# EAGLE design sdlogger (EAGLE 5.10)
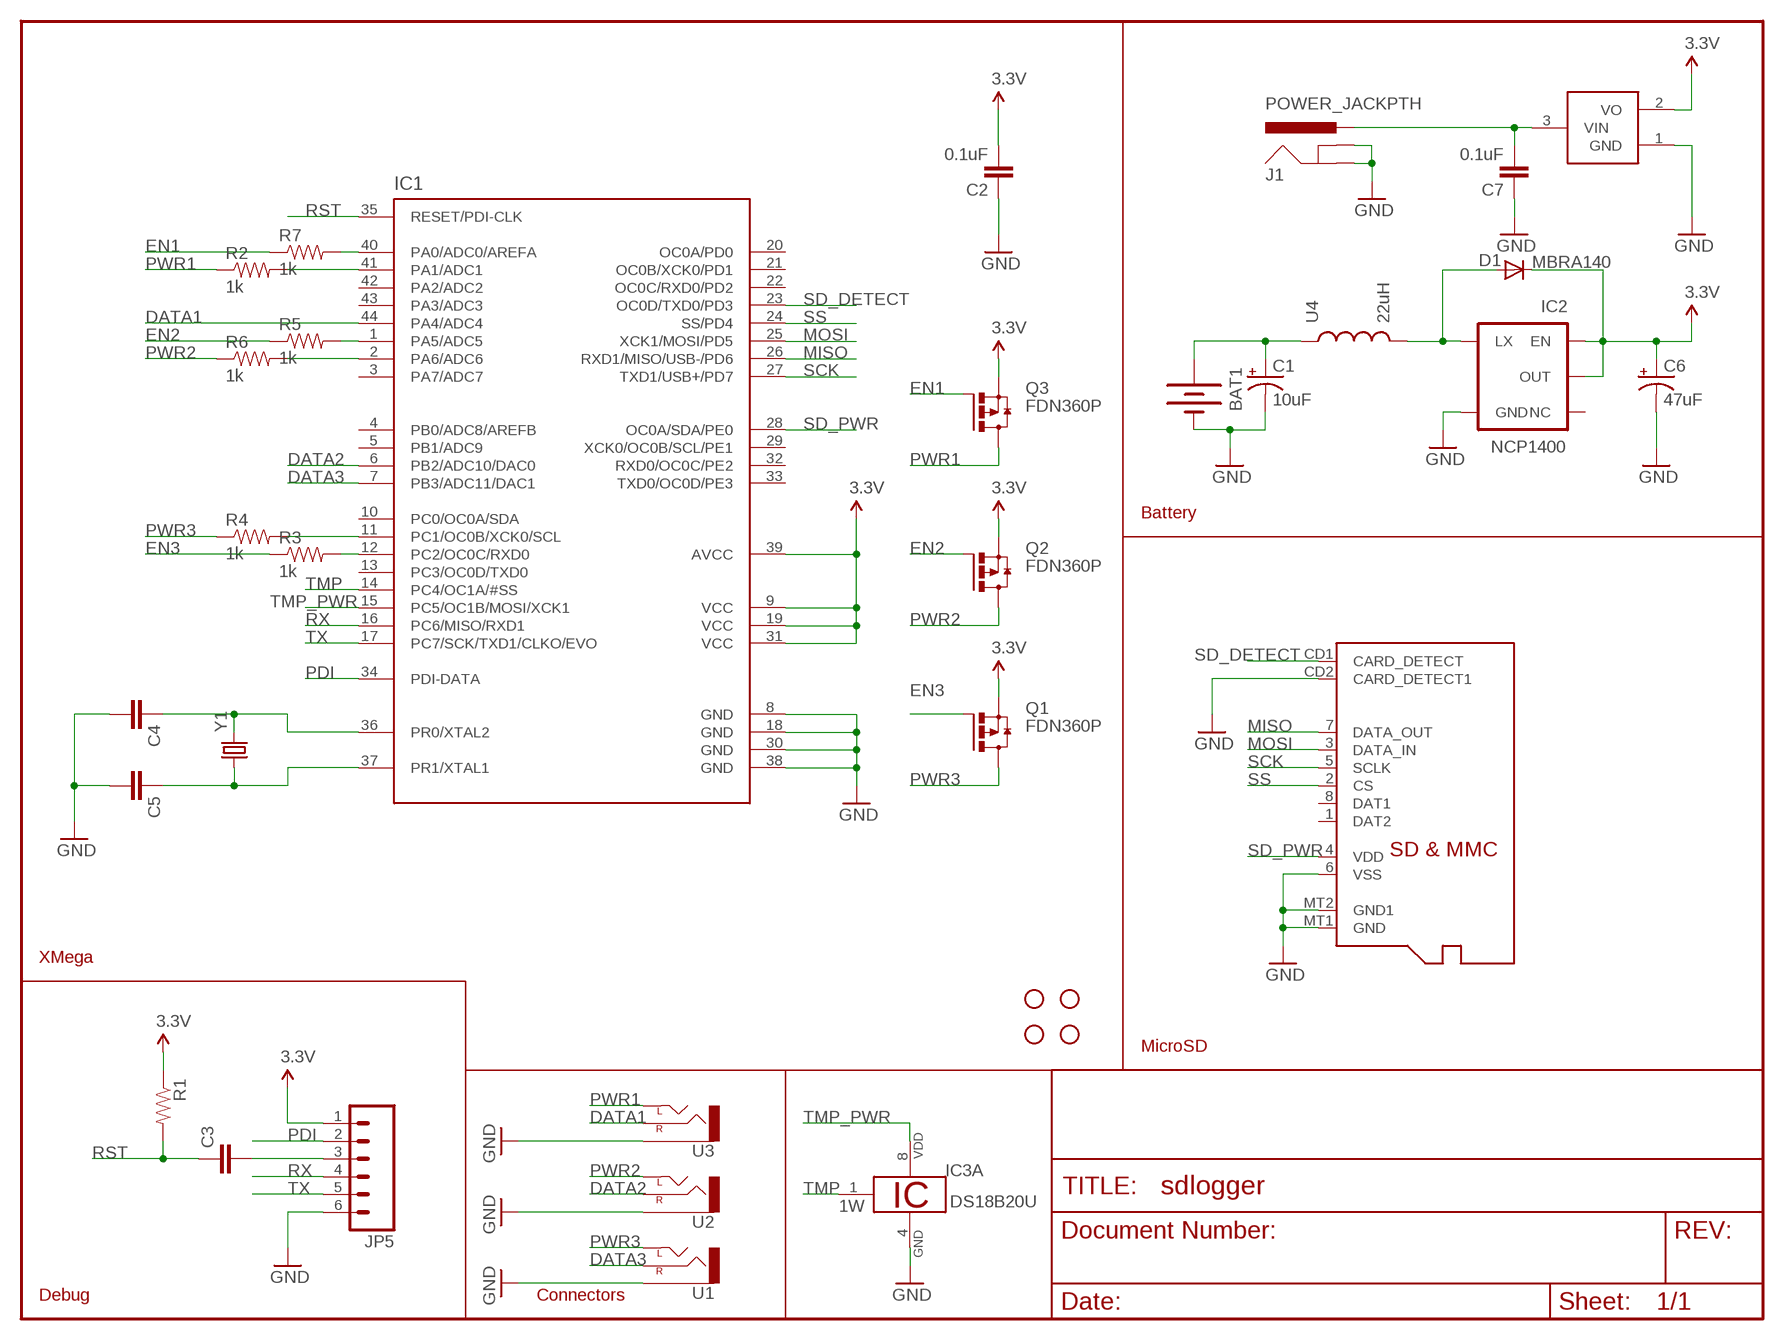
[diagram p0: schematic, sheet 1]

## Parts
BAT1  BATTERY20SMD  [BATTCON_20MM]
C1  10uF  CAP_POL1206  [EIA3216]
C2  0.1uF  CAP0603-CAP  [0603-CAP]
C3  CAP0603-CAP  [0603-CAP]
C4  CAP0603-CAP  [0603-CAP]
C5  CAP0603-CAP  [0603-CAP]
C6  47uF  CAP_POL1206  [EIA3216]
C7  0.1uF  CAP0603-CAP  [0603-CAP]
D1  MBRA140  DIODESMA  [SMA-DIODE]
IC1  ATXMEGAXXA4U  [TQFP-44]
IC2  NCP1400  V_REG_NCP1400SOT23-5  [SOT23-5]
IC3  DS18B20U  [UMAX8]
J1  POWER_JACKPTH  [POWER_JACK_PTH]
JP1  STAND-OFF  [STAND-OFF]
JP2  STAND-OFF  [STAND-OFF]
JP3  STAND-OFF  [STAND-OFF]
JP4  STAND-OFF  [STAND-OFF]
JP5  M06LONGPADS  [1X06_LONGPADS]
Q1  FDN360P  [SUPER-SOT3]
Q2  FDN360P  [SUPER-SOT3]
Q3  FDN360P  [SUPER-SOT3]
R1  RESISTOR0603-RES  [0603-RES]
R2  1k  RESISTOR0603-RES  [0603-RES]
R3  1k  RESISTOR0603-RES  [0603-RES]
R4  1k  RESISTOR0603-RES  [0603-RES]
R5  1k  RESISTOR0603-RES  [0603-RES]
R6  1k  RESISTOR0603-RES  [0603-RES]
R7  1k  RESISTOR0603-RES  [0603-RES]
U1  AUDIO-JACK2.5MM  [STEREOJACK2.5MM_STEREOJACK2.5MM]
U2  AUDIO-JACK2.5MM  [STEREOJACK2.5MM_STEREOJACK2.5MM]
U3  AUDIO-JACK2.5MM  [STEREOJACK2.5MM_STEREOJACK2.5MM]
U4  22uH  INDUCTORCR54  [CR54]
U$1  MICROSD  [MICROSD]
U$3  VREG  [SOT23-3]
Y1  CRYSTAL5X3  [CRYSTAL-SMD-5X3]

## Nets
3.3V: C2.2 C6.A(+) D1.C IC1.9(VCC) IC1.19(VCC) IC1.31(VCC) IC1.39(AVCC) IC2.1(EN) IC2.2(OUT) JP5.1 Q1.2(S) Q2.2(S) Q3.2(S) R1.1 U$3.2(VO)
BAT: BAT1.1(+) C1.A(+) U4.P$1
DATA1: IC1.44(PA4/ADC4) U3.TIP(RIGHT)
DATA2: IC1.6(PB2/ADC10/DAC0) U2.TIP(RIGHT)
DATA3: IC1.7(PB3/ADC11/DAC1) U1.TIP(RIGHT)
DC: C7.2 J1.PWR U$3.3(VIN)
EN1: Q3.1(G) R7.1
EN2: Q2.1(G) R5.1
EN3: Q1.1(G) R3.1
GND: BAT1.2(-) C1.C(-) C2.1 C4.2 C5.2 C6.C(-) C7.1 IC1.8(GND) IC1.18(GND) IC1.30(GND) IC1.38(GND) IC2.4(GND) IC3.4 J1.GND J1.GNDBREAK JP5.6 U1.RING1(SLEEVE) U2.RING1(SLEEVE) U3.RING1(SLEEVE) U$1.6(VSS) U$1.CD2(CARD_DETECT1) U$1.MT1(GND) U$1.MT2(GND1) U$3.1(GND)
MISO: IC1.26(RXD1/MISO/USB-/PD6) U$1.7(DATA_OUT)
MOSI: IC1.25(XCK1/MOSI/PD5) U$1.3(DATA_IN)
N$1: C3.2 JP5.3
N$2: C4.1 IC1.36(PR0/XTAL2) Y1.3
N$3: C5.1 IC1.37(PR1/XTAL1) Y1.1
N$4: D1.A IC2.5(LX) U4.P$2
N$5: IC1.41(PA1/ADC1) R2.2
N$6: IC1.11(PC1/OC0B/XCK0/SCL) R4.2
N$7: IC1.12(PC2/OC0C/RXD0) R3.2
N$8: IC1.1(PA5/ADC5) R5.2
N$9: IC1.2(PA6/ADC6) R6.2
N$10: IC1.40(PA0/ADC0/AREFA) R7.2
PDI: IC1.34(PDI-DATA) JP5.2
PWR1: Q3.3(D) R2.1 U3.SHIELD(LEFT)
PWR2: Q2.3(D) R6.1 U2.SHIELD(LEFT)
PWR3: Q1.3(D) R4.1 U1.SHIELD(LEFT)
RST: C3.1 IC1.35(RESET/PDI-CLK) R1.2
RX: IC1.16(PC6/MISO/RXD1) JP5.4
SCK: IC1.27(TXD1/USB+/PD7) U$1.5(SCLK)
SD_DETECT: IC1.23(OC0D/TXD0/PD3) U$1.CD1(CARD_DETECT)
SD_PWR: IC1.28(OC0A/SDA/PE0) U$1.4(VDD)
SS: IC1.24(SS/PD4) U$1.2(CS)
TMP: IC1.14(PC4/OC1A/#SS) IC3.1
TMP_PWR: IC1.15(PC5/OC1B/MOSI/XCK1) IC3.8
TX: IC1.17(PC7/SCK/TXD1/CLKO/EVO) JP5.5
Unconnected: IC1.3(PA7/ADC7) IC1.4(PB0/ADC8/AREFB) IC1.5(PB1/ADC9) IC1.10(PC0/OC0A/SDA) IC1.13(PC3/OC0D/TXD0) IC1.20(OC0A/PD0) IC1.21(OC0B/XCK0/PD1) IC1.22(OC0C/RXD0/PD2) IC1.29(XCK0/OC0B/SCL/PE1) IC1.32(RXD0/OC0C/PE2) IC1.33(TXD0/OC0D/PE3) IC1.42(PA2/ADC2) IC1.43(PA3/ADC3) IC2.3(NC) U$1.1(DAT2) U$1.8(DAT1)

## Notes on the sheet
- Battery
- XMega
- MicroSD
- Debug | Connectors

## Library data of the parts
BAT1 = sparkfun:BATTERY: Battery Holders Various common sizes : AA, AAA, 20mm coin cell and 12mm coin cell.
C1 C6 = sparkfun:CAP_POL: Capacitor Polarized These are standard SMD and PTH capacitors. Normally 10uF, 47uF, and 100uF in electrolytic and tantalum varieties. Always verify the external diameter of the through hole cap, it varies with capacity, voltage, and manufacturer. The EIA devices should be standard.
C2-C5 C7 = sparkfun:CAP: Capacitor Standard 0603 ceramic capacitor, and 0.1" leaded capacitor.
D1 = sparkfun:DIODE: Diode These are standard reverse protection diodes and small signal diodes. SMA package can handle up to about 1A. SOD-323 can handle about 200mA. What the SOD-323 package when ordering, there are some mfgs out there that are 5-pin packages.
IC1 = nonolith:ATXMEGAXXA4U: ATXMEGA A4U Series (XMEGA+USB)
IC2 = sparkfun:V_REG_NCP1400: Switching step-up voltage regulator NCP1400 switiching regulator takes single cell AA and outputs 100mA at 3.3V or 5V with minimal number of external components.
IC3 = ds18b20:DS18B20: Programmable Resolution Digital Thermometer This chip provides a onewire thermosensor with approx. 0.5°C accuracy. A programmable over/undertemperure alarm is available. The precision can be set from 9..12 bits. Notes: Vdd must be applied for accurate measurements at low temperatures, as the parasite power circuit otherwise heats the sensor. If parasite power is used, Vdd has to be connected to GND. The DS1822 is a low-cost thermometer chip, the DS18S20 is similar to the DS18B20, but with 9 Bit precision only. Author: Jan Kandziora <jjj@gmx.de>
J1 = sparkfun:POWER_JACK: Power Jack This is the standard 5.5mm barrel jack for power. The PTH is the most common, proven, reliable, footprint. All others are experimental. The Slot footprint only works if the mill layer is transmitted to the PCB fab house so be warned. Spark Fun Electronics SKU : PRT-00119. Mating wall wart : TOL-00298 (and others)
JP1-JP4 = sparkfun:STAND-OFF: Stand Off This is the mechanical footprint for a #4 phillips button head screw. Use the keepout ring to avoid running the screw head into surrounding components. SKU : PRT-00447
JP5 = sparkfun:M06: Header 6 Standard 6-pin 0.1" header. Use with straight break away headers (SKU : PRT-00116), right angle break away headers (PRT-00553), swiss pins (PRT-00743), machine pins (PRT-00117), and female headers (PRT-00115). Molex polarized connector foot print use with SKU : PRT-08094 with associated crimp pins and housings. NOTES ON THE VARIANTS LOCK and LOCK_LONGPADS... This footprint was designed to help hold the alignment of a through-hole component (i.e. 6-pin header) while soldering it into place. You may notice that each hole has been shifted either up or down by 0.005 of an inch from it's more standard position (which is a perfectly straight line). This slight alteration caused the pins (the squares in the middle) to touch the edges of the holes. Because they are alternating, it causes a "brace" to hold the component in place. 0.005 has proven to be the perfect amount of "off-center" position when using our standard breakaway headers. Although looks a little odd when you look at the bare footprint, once you have a header in there, the alteration is very hard to notice. Also, if you push a header all the way into place, it is covered up entirely on the bottom side. This idea of altering the position of holes to aid alignment will be further integrated into the Sparkfun Library for other footprints. It can help hold any component with 3 or more connection pins.
Q1-Q3 = transistor-power:FDN360P: Single P-Channel, PowerTrench (R) MOSFET Source: http://www.fairchildsemi.com/ds/FD/FDN360P.pdf
R1-R7 = sparkfun:RESISTOR: Resistor Basic schematic elements and footprints for 0603, 1206, and PTH resistors.
U1-U3 = sparkfun:AUDIO-JACK: 3.5mm Audio Jack Simple 3.5mm common PCB mount audio jack. SKU: PRT-08032
U4 = sparkfun:INDUCTOR: Inductors Basic Inductor/Choke - 0603 and 1206. Footprints are not proven and vary greatly between part numbers.
U$1 = adafruit:MICROSD: Micro-SD / Transflash card holder with SPI pinout For the 3M # 2908-05WB-MG and/or 4UCON #19656 push-push type
U$3 = nonolith:VREG
Y1 = sparkfun:CRYSTAL: Crystals Various standard crystals. Proven footprints. Spark Fun Electronics SKU : COM-00534

## Board
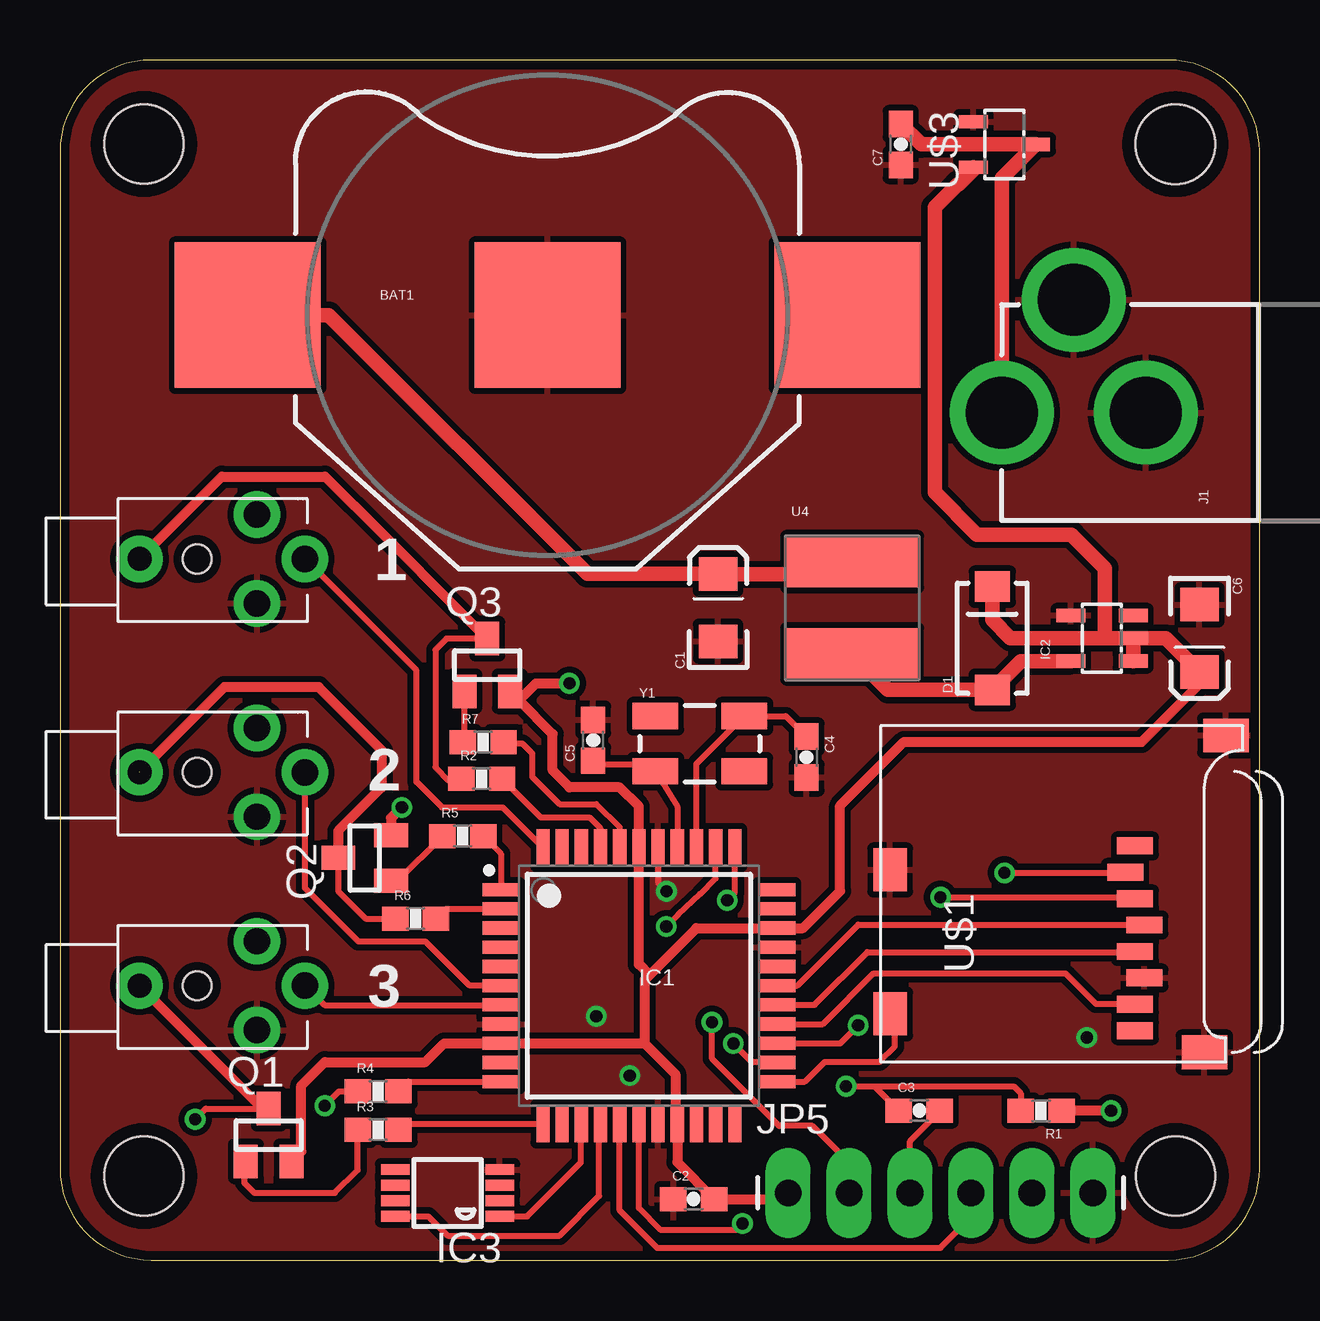
[diagram p1: board, top side]
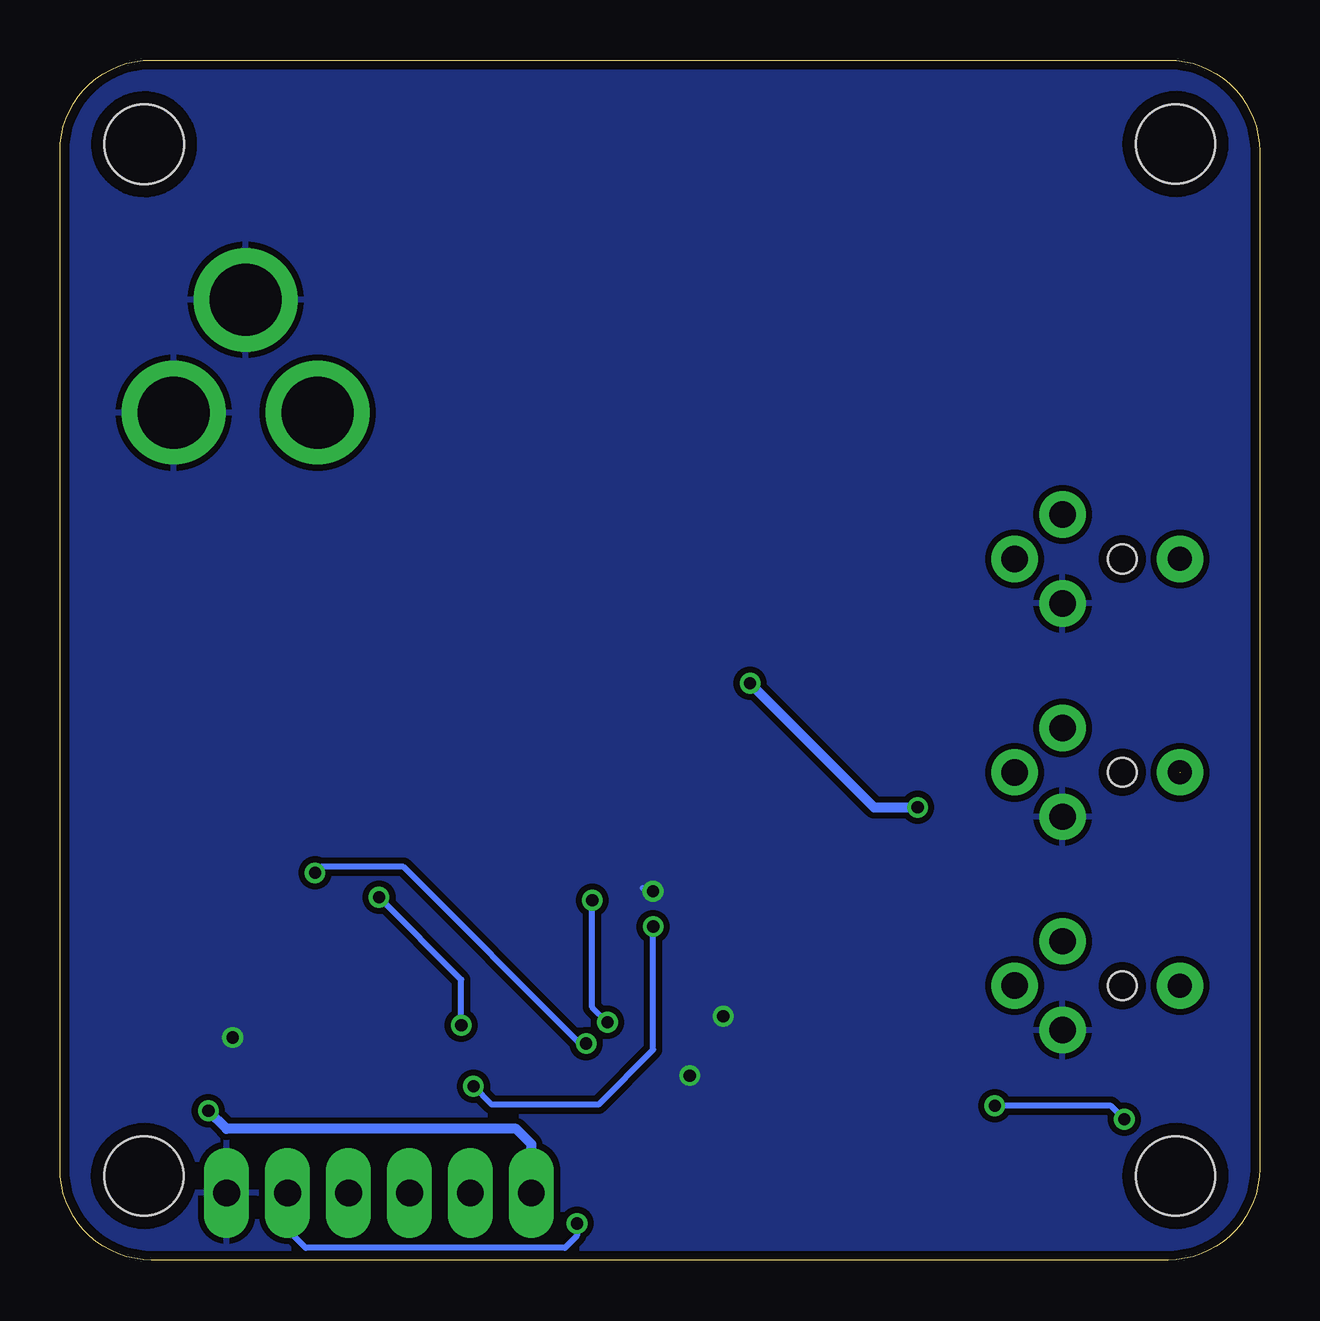
[diagram p2: board, bottom side, seen from below]

Size 50 x 50 mm. Coordinates in mm from the lower left corner, seen from the top.
Outline: 3.81,50 arc90 0,46.19 0,3.81 arc90 3.81,0 46.19,0 arc90 50,3.81 50,46.19 arc90 46.19,50 3.81,50
Copper layers (1*16): Top 0.0356mm / dielectric 1.5011mm / Bottom 0.0356mm
Design rules "LaenPCBOrder": minimum track width 6mil, minimum drill 13mil, track to track 6mil, track to pad 6mil, pad to pad 6mil, via to via 6mil, smd to smd 6mil, copper to edge 15mil, drill to drill 6mil, minimum pad ring 7mil, minimum via ring 7mil, stop-mask expansion 4mil, vias tented up to drill 0mil, thermal gap 10mil

### Footprints (pad centres in the part's own frame; a part is rotated, then mirrored left to right if it is on the bottom)
BATTCON_20MM = smd 6.07 x 6.07: 1 -12.5,0; 2 0,0; 3 12.5,0
EIA3216 = smd 1.4 x 1.6: A 1.4,0; C -1.4,0
0603-CAP = smd 1.1 x 1: 1 -0.85,0; 2 0.85,0
SMA-DIODE = smd 1.27 x 1.47: A -2.15,0; C 2.15,0
TQFP-44 = smd 1.55 x 0.55: 1 -5.75,4; 2 -5.75,3.2; 3 -5.75,2.4; 4 -5.75,1.6; 5 -5.75,0.8; 6 -5.75,0; 7 -5.75,-0.8; 8 -5.75,-1.6; 9 -5.75,-2.4; 10 -5.75,-3.2; 11 -5.75,-4; 23 5.75,-4; 24 5.75,-3.2; 25 5.75,-2.4; 26 5.75,-1.6; 27 5.75,-0.8; 28 5.75,0; 29 5.75,0.8; 30 5.75,1.6; 31 5.75,2.4; 32 5.75,3.2; 33 5.75,4 | smd 0.55 x 1.55: 12 -4,-5.75; 13 -3.2,-5.75; 14 -2.4,-5.75; 15 -1.6,-5.75; 16 -0.8,-5.75; 17 0,-5.75; 18 0.8,-5.75; 19 1.6,-5.75; 20 2.4,-5.75; 21 3.2,-5.75; 22 4,-5.75; 34 4,5.75; 35 3.2,5.75; 36 2.4,5.75; 37 1.6,5.75; 38 0.8,5.75; 39 0,5.75; 40 -0.8,5.75; 41 -1.6,5.75; 42 -2.4,5.75; 43 -3.2,5.75; 44 -4,5.75
SOT23-5 = smd 0.55 x 1.2: 1 -0.95,-1.3; 2 0,-1.3; 3 0.95,-1.3; 4 0.95,1.3; 5 -0.95,1.3
UMAX8 = smd 0.45 x 1.2: 1 -0.975,-2.175; 2 -0.325,-2.175; 3 0.325,-2.175; 4 0.975,-2.175; 5 0.975,2.175; 6 0.325,2.175; 7 -0.325,2.175; 8 -0.975,2.175
POWER_JACK_PTH = drill 2.997 pad 4.318 round: GND 0,7.7; GNDBREAK 4.7,10.7; PWR 0,13.7
STAND-OFF = hole 3.302: 0,0
1X06_LONGPADS = drill 1.118 pad 1.88 long: 1 0,0; 2 2.54,0; 3 5.08,0; 4 7.62,0; 5 10.16,0; 6 12.7,0
SUPER-SOT3 = smd 1 x 1.4: 1 -0.95,-1.1; 2 0.95,-1.1; 3 0,1.1
0603-RES = smd 1.1 x 1: 1 -0.85,0; 2 0.85,0
STEREOJACK2.5MM_STEREOJACK2.5MM = drill 1.1 pad 1.93 round: RING1 2.5,-1.85; RING2 2.5,1.85; TIP 4.5,0 | drill 1 pad 1.93 round: SHIELD -2.4,0 | hole 1.2: 0,0
CR54 = smd 5.5 x 2.15: P$1 0,1.92; P$2 0,-1.92
MICROSD = smd 0.7 x 1.5: 1 9,-10.64; 2 7.9,-10.24; 3 6.8,-10.64; 4 5.7,-11.04; 5 4.6,-10.64; 6 3.5,-11.04; 7 2.4,-10.64; 8 1.3,-10.64 | smd 1.8 x 1.4: CD1 2,-0.44; CD2 8,-0.44 | smd 1.4 x 1.9: MT1 0.4,-13.54; MT2 13.6,-14.44
SOT23-3 = smd 0.55 x 1.2: 1 0.95,1.3; 2 -0.95,1.3; 3 0,-1.3
CRYSTAL-SMD-5X3 = smd 1.9 x 1.1: 1 -1.85,-1.15; 2 1.85,-1.15; 3 1.85,1.15; 4 -1.85,1.15

### Placement (x,y rotation side)
BAT1  20.32,39.37 0 top
C1  27.43,27.18 90 top
C2  26.42,2.54 0 top
C3  35.81,6.22 0 top
C4  31.11,20.95 270 top
C5  22.23,21.65 90 top
C6  47.5,25.91 270 top
C7  35.05,46.48 90 top
D1  38.86,25.91 90 top
IC1  24.13,11.43 0 top
IC2  43.43,25.91 90 top
IC3  16.15,2.79 90 top
J1  52.96,35.31 90 top
JP1  3.5,3.5 0 top
JP2  46.49,46.49 0 top
JP3  3.5,46.5 0 top
JP4  46.5,3.5 0 top
JP5  30.35,2.79 0 top
Q1  8.7,5.21 0 top
Q2  12.7,16.75 90 top
Q3  17.81,24.79 0 top
R1  40.89,6.22 180 top
R2  17.58,20.05 0 top
R3  13.26,5.42 0 top
R4  13.26,7.02 0 top
R5  16.79,17.67 0 top
R6  14.82,14.22 0 top
R7  17.64,21.58 0 top
U1  5.71,11.43 0 top
U2  5.71,20.32 0 top
U3  5.71,29.21 0 top
U4  33.02,27.18 0 top
U$1  34.16,8.26 90 top
U$3  39.37,46.48 90 top
Y1  26.67,21.51 0 top

### Tracks (layer width: path | path; a pad name or v marks a point on that pad's centre or on a via)
3.3V  (via drill 0.51)
  Top 0.406: 24.37,9.03 IC1.9 16.02,9.03 15.23,8.24 11.04,8.24 10.06,7.26 10.06,4.52 Q1.2 | 24.37,9.03 25.65,7.75 25.65,5.76 IC1.19 25.73,4.08 C2.2 30.1,2.54 JP5.1 | 24.57,11.87 24.38,11.68 24.38,9.04 24.37,9.03 | 24.57,11.87 26.53,13.83 IC1.31 30.98,13.83 32.51,15.37 32.51,18.92 35.18,21.59 45.09,21.59 47.5,24 C6.A | 24.57,11.87 24.13,12.32 IC1.39 24.13,18.9 23.33,19.7 21.23,19.7 20.54,20.4 20.54,21.91 19.13,23.32 | 19.13,23.32 Q3.2 | Q2.2 13.8,18.41 v14.25,18.86 | v21.23,24.03 19.84,24.03 19.13,23.32 | v43.81,6.22 R1.1
  Top 0.61: 43.56,25.91 39.62,25.91 38.86,26.67 D1.C | IC2.2 43.56,25.91 | IC2.2 IC2.1 | IC2.2 46.1,25.91 C6.A | U$3.2 38.07,45.44 37.47,44.83 37.43,44.83 36.46,43.87 36.46,31.99 38.23,30.23 42.16,30.23 43.56,28.83 43.56,25.91
  Bottom 0.406: v14.25,18.86 16.07,18.86 v21.23,24.03 | JP5.1 30.35,4.83 30.99,5.46 43.05,5.46 v43.81,6.22
BAT
  Top 0.61: U4.P$1 32.5,28.58 C1.A 27.93,28.59 21.98,28.59 11.2,39.37 BAT1.1
DATA1
  Top 0.254: IC1.44 18.45,18.86 15.93,18.86 14.86,19.93 14.86,24.57 U3.TIP
DATA2
  Top 0.254: IC1.6 18.36,11.46 17.04,11.46 15.23,13.27 12.43,13.27 10.21,15.49 U2.TIP
DATA3
  Top 0.254: IC1.7 18.37,10.62 11.03,10.62 U1.TIP
DC
  Top 0.61: C7.2 35.9,46.48 U$3.3 39.26,45.07 J1.PWR
EN1
  Top 0.254: Q3.1 16.86,21.64 R7.1
EN2
  Top 0.254: Q2.1 14.07,15.8 R5.1
EN3
  Top 0.254: R3.1 12.41,3.75 11.46,2.79 8.1,2.79 7.68,3.21 7.68,4.04 Q1.1
GND  (via drill 0.51)
  Top 0.254: v42.8,9.27 42.85,9.21 | IC1.38 24.93,15.72 v25.29,15.37
  Bottom 0.254: v42.8,9.27 42.67,9.27 42.55,9.14 | v25.29,15.37 25.57,15.37 25.7,15.51
  other vias: 22.35,10.16 23.75,7.68
  pour Bottom (isolate 0.254): 0,50 50,50 50,0 0,0
  pour Top (isolate 0.254): 0,50 50,50 50,0 0,0
MISO
  Top 0.254: IC1.26 31.8,9.83 33.91,11.94 41.91,11.94 43.18,10.67 44.92,10.67 U$1.7
MOSI  (via drill 0.51)
  Top 0.254: IC1.25 32.52,9.03 v33.27,9.78 | v36.7,15.11 44.87,15.11 U$1.3
  Bottom 0.254: v33.27,9.78 33.27,11.68 v36.7,15.11
N$1
  Top 0.254: C3.2 36.66,6.18 35.43,4.95 JP5.3
N$2
  Top 0.254: IC1.36 26.53,20.67 Y1.3 30.26,22.66 C4.1
N$3
  Top 0.254: IC1.37 25.73,18.89 Y1.1 24.52,20.66 22.36,20.66 C5.1
N$4
  Top 0.61: U4.P$2 34.52,23.76 D1.A 40.06,24.96 IC2.5
N$5
  Top 0.254: IC1.41 22.53,17.98 22.07,18.44 20.04,18.44 R2.2
N$6
  Top 0.254: IC1.11 14.52,7.43 R4.2
N$7
  Top 0.254: IC1.12 14.37,5.68 R3.2
N$8
  Top 0.254: IC1.1 18.38,16.93 R5.2
N$9
  Top 0.254: IC1.2 16.08,14.63 R6.2
N$10
  Top 0.254: IC1.40 23.33,18.02 22.35,19 20.82,19 19.7,20.12 19.7,21.09 19.28,21.51 18.55,21.51 R7.2
PDI  (via drill 0.51)
  Top 0.254: IC1.34 28.13,15.3 v27.81,14.99 | v27.18,9.91 27.18,8.38 29.97,5.59 31.37,5.59 32.89,4.06 JP5.2
  Bottom 0.254: v27.81,14.99 27.81,10.54 v27.18,9.91
PWR1
  Top 0.254: Q3.3 16.11,25.89 15.65,25.43 15.65,20.54 16.2,19.98 16.65,19.98 R2.1 | 12.23,31.46 12.24,31.46
  Top 0.406: 12.24,31.46 Q3.3 | 12.23,31.46 11.05,32.64 6.74,32.64 U3.SHIELD
PWR2  (1 unrouted)
  Top 0.254: R6.1 12.74,14.22 11.6,15.37 Q2.3
  Top 0.406: Q2.3 11.6,17.88 13.41,19.7 13.41,21.23 10.79,23.85 10.79,23.88 6.86,23.88 U2.SHIELD
PWR3  (via drill 0.51)
  Top 0.254: R4.1 11.63,7.02 v11.04,6.43 | 8.44,6.31 6.08,6.31 v5.64,5.87
  Top 0.406: 8.68,6.29 Q1.3 8.44,6.31 U1.SHIELD
  Bottom 0.254: v11.04,6.43 6.2,6.43 v5.64,5.87
RST  (via drill 0.51)
  Top 0.254: IC1.35 27.33,15.9 26.67,15.24 25.78,14.4 v25.27,13.89 | v32.77,7.24 33.27,7.24 33.95,7.24 | 33.95,7.24 C3.1 | R1.2 40.04,6.95 39.75,7.24 33.95,7.24
  Bottom 0.254: v25.27,13.89 25.27,8.76 27.56,6.48 32,6.48 v32.77,7.24
RX
  Top 0.254: IC1.16 23.33,2.07 24.89,0.51 36.7,0.51 37.97,1.78 JP5.4
SCK
  Top 0.254: IC1.27 31.46,10.63 33.66,12.83 44.9,12.83 U$1.5
SD_DETECT
  Top 0.254: IC1.23 31.05,7.43 31.88,8.26 34.16,8.26 34.8,8.89 34.8,10.19 U$1.CD1
SD_PWR
  Top 0.254: IC1.28 30.73,11.43 33.27,13.97 45.31,13.97 U$1.4
SS  (via drill 0.51)
  Top 0.254: IC1.24 28.85,8.23 v28.07,9.02 | v39.37,16.13 44.5,16.13 U$1.2
  Bottom 0.254: v28.07,9.02 28.32,9.02 35.69,16.38 39.12,16.38 v39.37,16.13
TMP
  Top 0.254: IC3.1 19.47,1.82 21.72,4.06 21.72,5.67 IC1.14
TMP_PWR
  Top 0.254: IC3.8 15.35,1.82 16.15,1.02 20.83,1.02 22.48,2.67 22.48,5.63 IC1.15
TX  (via drill 0.51)
  Top 0.254: IC1.17 24.13,2.16 25.02,1.27 28.19,1.27 v28.45,1.52
  Bottom 0.254: JP5.5 40.51,1.27 39.75,0.51 28.96,0.51 28.45,1.02 v28.45,1.52

### Text on the board
tPlace: 1 | 2 | 3